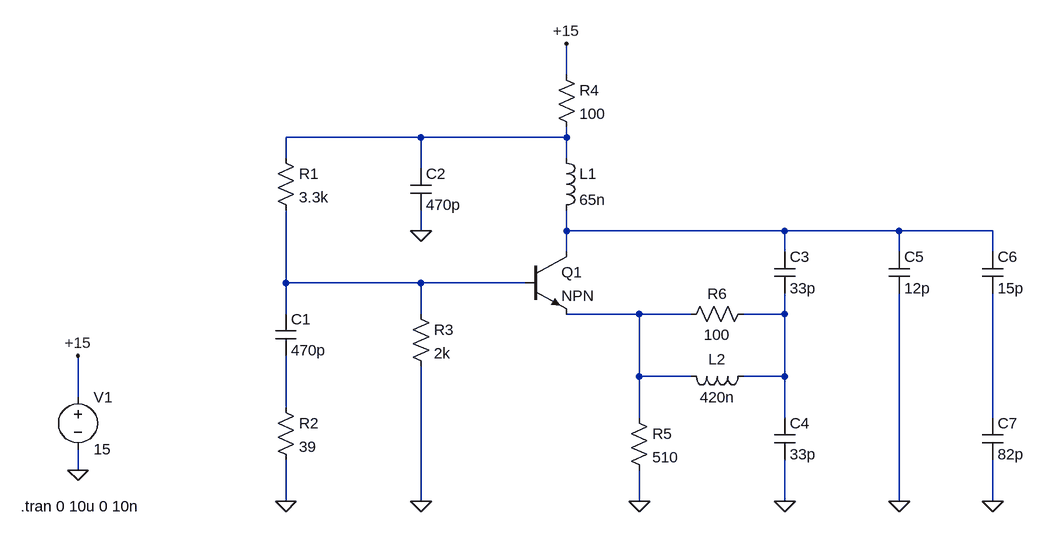
[diagram p0: schematic kanga-lo.asc]
kanga-lo.asc, the LTspice schematic file:
Version 4
SHEET 1 1160 680
WIRE 448 -272 448 -320
WIRE 224 -176 16 -176
WIRE 448 -176 448 -192
WIRE 448 -176 224 -176
WIRE 16 -144 16 -176
WIRE 448 -144 448 -176
WIRE 224 -128 224 -176
WIRE 224 -32 224 -64
WIRE 448 -32 448 -64
WIRE 784 -32 448 -32
WIRE 960 -32 784 -32
WIRE 1104 -32 960 -32
WIRE 448 0 448 -32
WIRE 784 0 784 -32
WIRE 960 0 960 -32
WIRE 1104 0 1104 -32
WIRE 16 48 16 -64
WIRE 224 48 16 48
WIRE 384 48 224 48
WIRE 16 96 16 48
WIRE 224 96 224 48
WIRE 560 96 448 96
WIRE 640 96 560 96
WIRE 784 96 784 64
WIRE 784 96 720 96
WIRE 560 192 560 96
WIRE 640 192 560 192
WIRE 784 192 784 96
WIRE 784 192 720 192
WIRE -304 224 -304 160
WIRE 16 240 16 160
WIRE 560 256 560 192
WIRE 784 256 784 192
WIRE 1104 256 1104 64
WIRE -304 336 -304 304
WIRE 16 384 16 320
WIRE 224 384 224 176
WIRE 560 384 560 336
WIRE 784 384 784 320
WIRE 960 384 960 64
WIRE 1104 384 1104 320
FLAG 16 384 0
FLAG 224 384 0
FLAG 448 -320 +15
FLAG -304 336 0
FLAG -304 160 +15
FLAG 560 384 0
FLAG 784 384 0
FLAG 960 384 0
FLAG 1104 384 0
FLAG 224 -32 0
SYMBOL res 0 -160 R0
SYMATTR InstName R1
SYMATTR Value 3.3k
SYMBOL res 0 224 R0
SYMATTR InstName R2
SYMATTR Value 39
SYMBOL res 208 80 R0
SYMATTR InstName R3
SYMATTR Value 2k
SYMBOL res 432 -288 R0
SYMATTR InstName R4
SYMATTR Value 100
SYMBOL res 544 240 R0
SYMATTR InstName R5
SYMATTR Value 510
SYMBOL res 736 80 R90
WINDOW 0 0 56 VBottom 2
WINDOW 3 32 56 VTop 2
SYMATTR InstName R6
SYMATTR Value 100
SYMBOL cap 0 96 R0
SYMATTR InstName C1
SYMATTR Value 470p
SYMBOL cap 208 -128 R0
SYMATTR InstName C2
SYMATTR Value 470p
SYMBOL cap 768 0 R0
SYMATTR InstName C3
SYMATTR Value 33p
SYMBOL cap 768 256 R0
SYMATTR InstName C4
SYMATTR Value 33p
SYMBOL cap 944 0 R0
SYMATTR InstName C5
SYMATTR Value 12p
SYMBOL cap 1088 0 R0
SYMATTR InstName C6
SYMATTR Value 15p
SYMBOL cap 1088 256 R0
SYMATTR InstName C7
SYMATTR Value 82p
SYMBOL npn 384 0 R0
SYMATTR InstName Q1
SYMBOL voltage -304 208 R0
WINDOW 123 0 0 Left 0
WINDOW 39 0 0 Left 0
SYMATTR InstName V1
SYMATTR Value 15
SYMBOL ind 432 -160 R0
SYMATTR InstName L1
SYMATTR Value 65n
SYMBOL ind 736 176 R90
WINDOW 0 5 56 VBottom 2
WINDOW 3 32 56 VTop 2
SYMATTR InstName L2
SYMATTR Value 420n
TEXT -392 392 Left 2 !.tran 0 10u 0 10n

The netlist it stands for:
* kanga-lo.asc
R1 N001 N003 3.3k
R2 N006 0 39
R3 N003 0 2k
R4 +15 N001 100
R5 N004 0 510
R6 N005 N004 100
C1 N003 N006 470p
C2 N001 0 470p
C3 N002 N005 33p
C4 N005 0 33p
C5 N002 0 12p
C6 N002 N007 15p
C7 N007 0 82p
Q1 N002 N003 N004 0 NPN
V1 +15 0 15
L1 N001 N002 65n
L2 N005 N004 420n
.model NPN NPN
.model PNP PNP
.lib standard.bjt
.tran 0 10u 0 10n
.backanno
.end